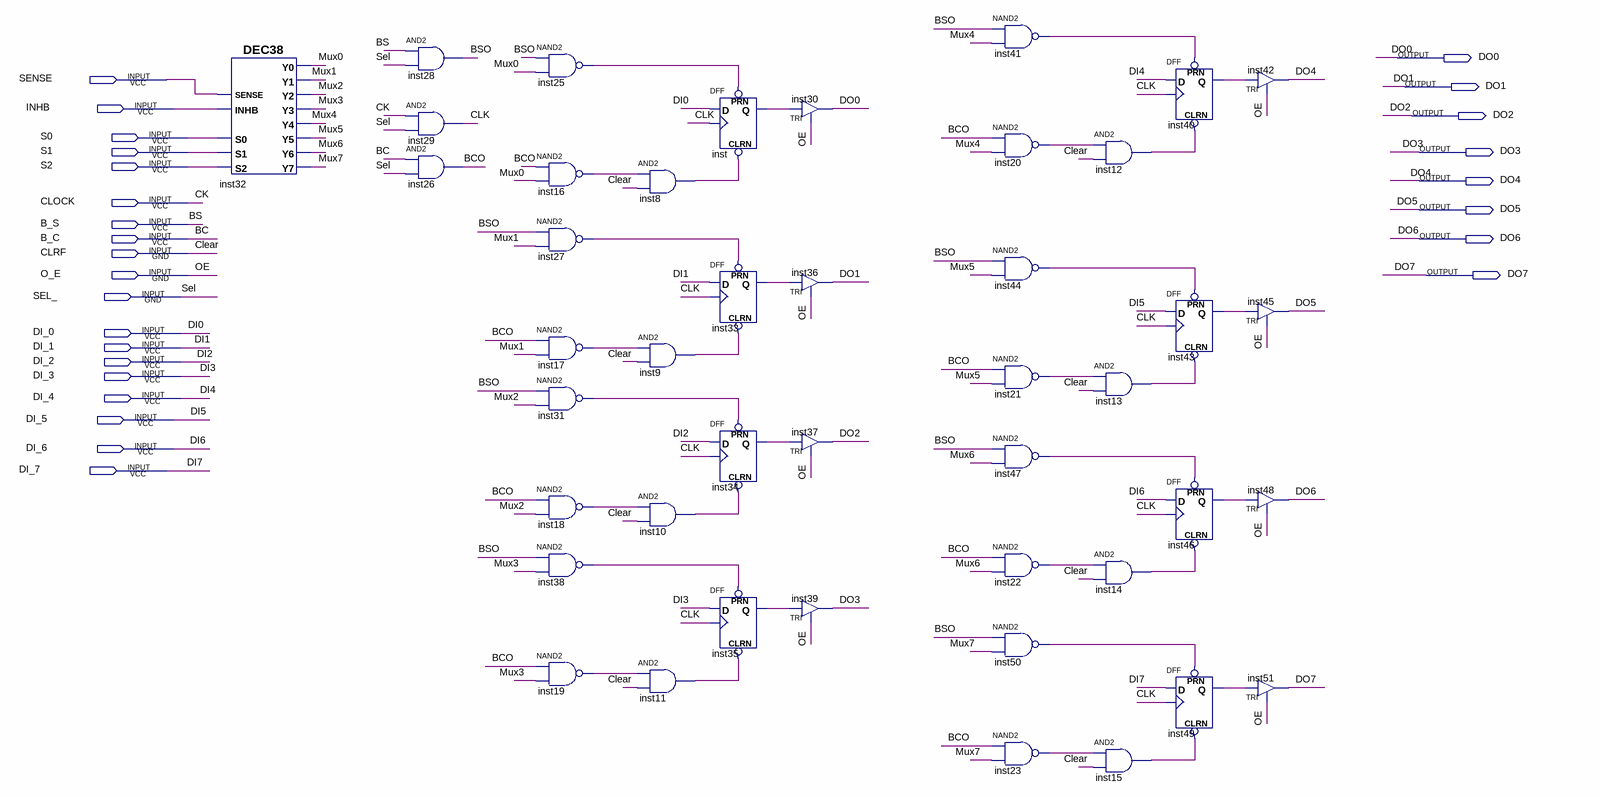
[diagram p0: schematic sheet]
// Quartus schematic PIC.bdf as structural Verilog: 44 symbols, 27 pins
module PIC (
  input  SENSE,
  input  INHB,
  input  S0,
  input  S1,
  input  S2,
  input  CLOCK,
  input  B_S,
  input  B_C,
  input  CLRF,
  input  O_E,
  input  SEL_,
  input  DI_0,
  input  DI_1,
  input  DI_2,
  input  DI_3,
  input  DI_4,
  input  DI_5,
  input  DI_6,
  input  DI_7,
  output DO0,
  output DO1,
  output DO2,
  output DO3,
  output DO4,
  output DO5,
  output DO6,
  output DO7
);

  wire BCO, BSO, CLK, inst8_out, inst9_out, inst10_out, inst11_out, inst12_out, inst13_out, inst14_out,
       inst15_out, inst16_out, inst17_out, inst18_out, inst19_out, inst20_out, inst21_out, inst22_out,
       inst23_out, inst25_out, inst27_out, inst31_out, inst33_q, inst34_q, inst35_q, inst38_out, inst40_q,
       inst41_out, inst43_q, inst44_out, inst46_q, inst47_out, inst49_q, inst50_out, inst_q, Mux0, Mux1,
       Mux2, Mux3, Mux4, Mux5, Mux6, Mux7;

  DEC38 inst32 (
    .S2(S2), .S1(S1), .INHB(INHB), .S0(S0), .SENSE(SENSE), .Y7(Mux7), .Y6(Mux6), .Y5(Mux5), .Y3(Mux3),
    .Y4(Mux4), .Y0(Mux0), .Y1(Mux1), .Y2(Mux2));
  and inst28 (BSO, B_S, SEL_);
  and inst29 (CLK, CLOCK, SEL_);
  and inst26 (BCO, B_C, SEL_);
  nand inst25 (inst25_out, BSO, Mux0);
  nand inst16 (inst16_out, BCO, Mux0);
  nand inst27 (inst27_out, BSO, Mux1);
  nand inst17 (inst17_out, BCO, Mux1);
  nand inst31 (inst31_out, BSO, Mux2);
  nand inst18 (inst18_out, BCO, Mux2);
  nand inst38 (inst38_out, BSO, Mux3);
  nand inst19 (inst19_out, BCO, Mux3);
  and inst8 (inst8_out, inst16_out, CLRF);
  and inst9 (inst9_out, inst17_out, CLRF);
  and inst10 (inst10_out, inst18_out, CLRF);
  and inst11 (inst11_out, inst19_out, CLRF);
  DFF inst (.CLRN(inst8_out), .CLK(CLK), .D(DI_0), .PRN(inst25_out), .Q(inst_q));
  DFF inst33 (.CLRN(inst9_out), .CLK(CLK), .D(DI_1), .PRN(inst27_out), .Q(inst33_q));
  DFF inst34 (.CLRN(inst10_out), .CLK(CLK), .D(DI_2), .PRN(inst31_out), .Q(inst34_q));
  DFF inst35 (.CLRN(inst11_out), .CLK(CLK), .D(DI_3), .PRN(inst38_out), .Q(inst35_q));
  TRI inst30 (.IN(inst_q), .OE(O_E), .OUT(DO0));
  TRI inst36 (.IN(inst33_q), .OE(O_E), .OUT(DO1));
  TRI inst37 (.IN(inst34_q), .OE(O_E), .OUT(DO2));
  TRI inst39 (.IN(inst35_q), .OE(O_E), .OUT(DO3));
  nand inst41 (inst41_out, BSO, Mux4);
  nand inst20 (inst20_out, BCO, Mux4);
  nand inst44 (inst44_out, BSO, Mux5);
  nand inst21 (inst21_out, BCO, Mux5);
  nand inst47 (inst47_out, BSO, Mux6);
  nand inst22 (inst22_out, BCO, Mux6);
  nand inst50 (inst50_out, BSO, Mux7);
  nand inst23 (inst23_out, BCO, Mux7);
  and inst12 (inst12_out, inst20_out, CLRF);
  and inst13 (inst13_out, inst21_out, CLRF);
  and inst14 (inst14_out, inst22_out, CLRF);
  and inst15 (inst15_out, inst23_out, CLRF);
  DFF inst40 (.CLRN(inst12_out), .CLK(CLK), .D(DI_4), .PRN(inst41_out), .Q(inst40_q));
  DFF inst43 (.CLRN(inst13_out), .CLK(CLK), .D(DI_5), .PRN(inst44_out), .Q(inst43_q));
  DFF inst46 (.CLRN(inst14_out), .CLK(CLK), .D(DI_6), .PRN(inst47_out), .Q(inst46_q));
  DFF inst49 (.CLRN(inst15_out), .CLK(CLK), .D(DI_7), .PRN(inst50_out), .Q(inst49_q));
  TRI inst42 (.IN(inst40_q), .OE(O_E), .OUT(DO4));
  TRI inst45 (.IN(inst43_q), .OE(O_E), .OUT(DO5));
  TRI inst48 (.IN(inst46_q), .OE(O_E), .OUT(DO6));
  TRI inst51 (.IN(inst49_q), .OE(O_E), .OUT(DO7));

  // Other names for the same wires on the sheet: BC = B_C; BS = B_S; CK = CLOCK; Clear = CLRF; DI0 = DI_0; DI1 = DI_1;
  //   DI2 = DI_2; DI3 = DI_3; DI4 = DI_4; DI5 = DI_5; DI6 = DI_6; DI7 = DI_7; OE = O_E; Sel = SEL_
endmodule
